# Altium schematic sheet Sheet1.SchDoc
size A4
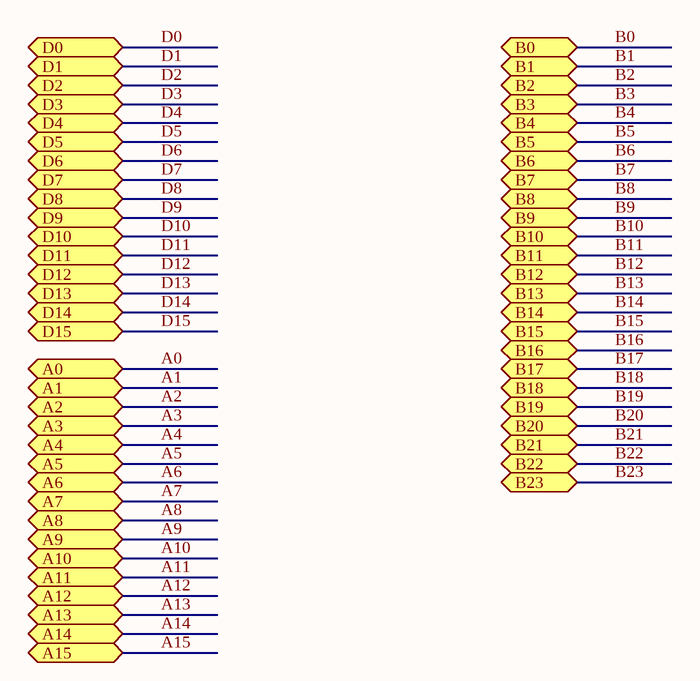
[diagram p0: Sheet1.SchDoc]

## Ports
A0 (bidir), A1 (bidir), A2 (bidir), A3 (bidir), A4 (bidir), A5 (bidir), A6 (bidir), A7 (bidir), A8 (bidir), A9 (bidir), A10 (bidir), A11 (bidir), A12 (bidir), A13 (bidir), A14 (bidir), A15 (bidir), B0 (bidir), B1 (bidir), B2 (bidir), B3 (bidir), B4 (bidir), B5 (bidir), B6 (bidir), B7 (bidir), B8 (bidir), B9 (bidir), B10 (bidir), B11 (bidir), B12 (bidir), B13 (bidir), B14 (bidir), B15 (bidir), B16 (bidir), B17 (bidir), B18 (bidir), B19 (bidir), B20 (bidir), B21 (bidir), B22 (bidir), B23 (bidir), D0 (bidir), D1 (bidir), D2 (bidir), D3 (bidir), D4 (bidir), D5 (bidir), D6 (bidir), D7 (bidir), D8 (bidir), D9 (bidir), D10 (bidir), D11 (bidir), D12 (bidir), D13 (bidir), D14 (bidir), D15 (bidir)

## Nets
A0: port A0
A1: port A1
A2: port A2
A3: port A3
A4: port A4
A5: port A5
A6: port A6
A7: port A7
A8: port A8
A9: port A9
A10: port A10
A11: port A11
A12: port A12
A13: port A13
A14: port A14
A15: port A15
B0: port B0
B1: port B1
B2: port B2
B3: port B3
B4: port B4
B5: port B5
B6: port B6
B7: port B7
B8: port B8
B9: port B9
B10: port B10
B11: port B11
B12: port B12
B13: port B13
B14: port B14
B15: port B15
B16: port B16
B17: port B17
B18: port B18
B19: port B19
B20: port B20
B21: port B21
B22: port B22
B23: port B23
D0: port D0
D1: port D1
D2: port D2
D3: port D3
D4: port D4
D5: port D5
D6: port D6
D7: port D7
D8: port D8
D9: port D9
D10: port D10
D11: port D11
D12: port D12
D13: port D13
D14: port D14
D15: port D15